# Altium schematic sheet LV_power.SchDoc
size A4; SheetNumber: 6; SheetTotal: 6
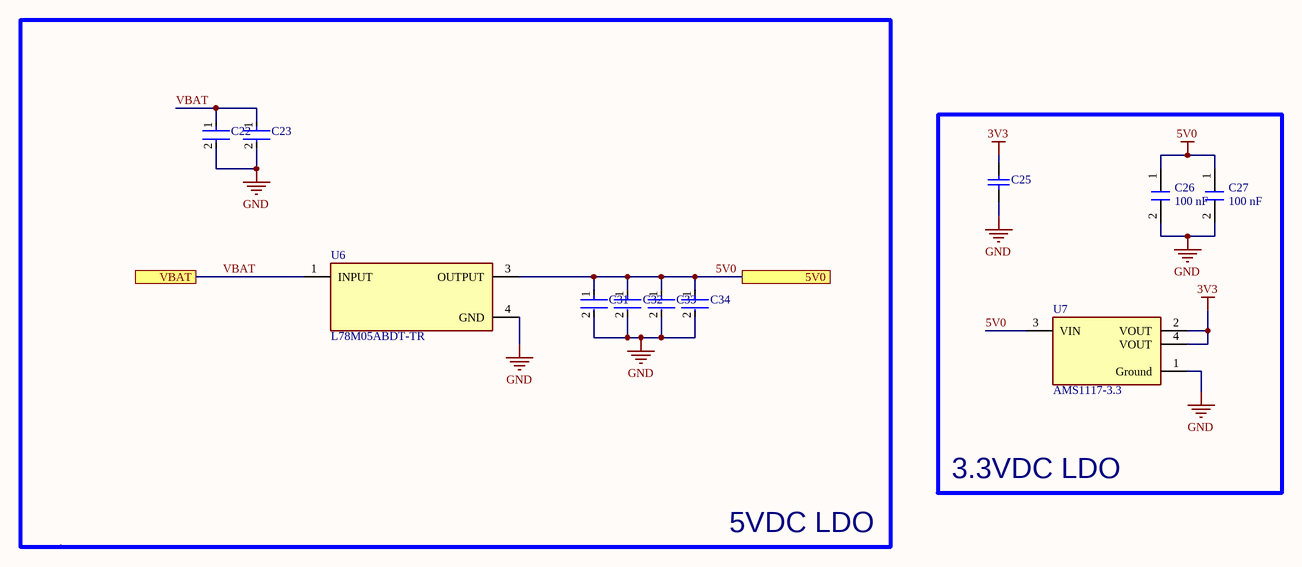
[diagram p0: LV_power.SchDoc]

## Parts
C22  CC0805MKX5R8BB226  [FP-CC0805-0_2-1_45-IPC_C]  (value not drawn)
C23  CC0805MKX5R8BB226  [FP-CC0805-0_2-1_45-IPC_C]  (value not drawn)
C25  0805ZG106ZAT2A  [CAPC2013X152X50NL20T25]  (value not drawn)
C26  value 100 nF  [0603_FP]  (hidden comment: Capacitor_0603)
C27  value 100 nF  [0603_FP]  (hidden comment: Capacitor_0603)
C31  GRM21BR61A476ME15K  [FP-GRM21B-0_2-e0_2_0_7-IPC_B]  (value not drawn)
C32  GRM21BR61A476ME15K  [FP-GRM21B-0_2-e0_2_0_7-IPC_B]  (value not drawn)
C33  GRM21BR61A476ME15K  [FP-GRM21B-0_2-e0_2_0_7-IPC_B]  (value not drawn)
C34  GRM21BR61A476ME15K  [FP-GRM21B-0_2-e0_2_0_7-IPC_B]  (value not drawn)
U6  L78M05ABDT-TR  [FP-L78M05ABDT-TR-MFG]
U7  AMS1117-3.3  [FP-AMS1117-IPC_C]

## Blocks framed on the sheet
5VDC LDO: C22 C23 C31-C34 U6
3.3VDC LDO: C25-C27 U7

## Ports
5V0 (see cd_switching[4B]), VBAT (see HV_power[1C], input_output[2D])

## Nets
3V3: C25.2 U7.2(VOUT) U7.4(VOUT)
5V0: C26.1 C27.1 C31.1 C32.1 C33.1 C34.1 U6.3(OUTPUT) U7.3(VIN) ; port 5V0
GND: C22.2 C23.2 C25.1 C26.2 C27.2 C31.2 C32.2 C33.2 C34.2 U6.4(GND) U7.1(Ground)
VBAT: C22.1 C23.1 U6.1(INPUT) ; port VBAT

## Library data of the parts
C22 C23 = CMP-03422-001497-1: CAP CER 22UF 25V X5R 0805; Tolerance: 20%; Max Operating Temperature: 85°C; Dielectric: X5R; Termination: SMD/SMT; Voltage Rating: 25V; Width: 0.049inch; Min Operating Temperature: -55°C; Case/Package: 0805; Lead Free: Lead Free; RoHS Compliant: Yes; Weight: 0.000194oz; Voltage Rating (DC): 25V; Capacitance: 22uF; Length: 0.079inch; Halogen Free: Halogen Free; Height: 1.25mm; Packaging: Tape and Reel; Package Quantity: 3000; Case Code (Metric): 2012; Thickness: 0.057inch; Case Code (Imperial): 0805; Mount: Surface Mount
C25 = CMP-2007-04523-1: Manufacturer: AVX Interconnect / Elco; Part Number: 0805ZG106ZAT2A
C26 C27 = Capacitor_0603: Format: 0402; Package: 0402
C31-C34 = CMP-06035-042633-1: Chip Multilayer Ceramic Capacitors for General Purpose, 0805, 47uF, X5R, 15%, 20%, 10V; Min Operating Temperature: -55°C; Max Operating Temperature: 85°C; Length: 0.079inch; Case Code (Imperial): 0805; Tolerance: 20%; Mount: Surface Mount; Voltage Rating (DC): 10V; Termination: SMD/SMT; Voltage Rating: 10V; Weight: 0.000335oz; Package Quantity: 10000; Dielectric: X5R; Thickness: 0.057inch; Capacitance: 47uF; Case/Package: 0805; Width: 0.049inch; Case Code (Metric): 2012; Packaging: Tape and Reel
U6 = CMP-0244-00177-2: IC REG LINEAR 5V 500MA DPAK; Polarity: Positive; Accuracy: 2%; Max Input Voltage: 35V; Tolerance: 4%; Power Supply Rejection Ratio (PSRR): 62dB; Dropout Voltage: 2V; Output Type: Fixed; Number of Regulators: 1; Min Input Voltage: 10V; Quiescent Current: 6mA; Mount: Surface Mount; Min Operating Temperature: -40°C; Lead Free: Lead Free; Number of Pins: 3; Height: 2.4mm; Weight: 0.01lb; Width: 6.2mm; Packaging: Tape and Reel; Output Current: 500mA; Output Voltage: 5V; Case/Package: TO-252; REACH SVHC: No SVHC; Max Operating Temperature: 125°C; Nominal Output Voltage: 5V; Number of Outputs: 1; Min Output Voltage: 5V; Radiation Hardening: No; Length: 6.6mm; Max Output Current: 500mA; Contact Plating: Tin; Output Voltage Accuracy: 2%; Package Quantity: 1
U7 = CMP-209535-000001-1: LDO Voltage Regulators 1A, 3.3V; Manufacturer: Advanced Monolithic Systems; Dropout Voltage: 1.1V; Output Type: Fixed; Nominal Supply Current: 5mA; Max Power Dissipation: 1.2W; Max Supply Voltage: 15V; Number Of Outputs: 1; Standoff Height: 0.64mm; Max Junction Temp: +125°C; Height: 1.8mm; Package: AMS1117; Device Class L2: Power Management ICs; ComponentLink2Description: Datasheet; ComponentLink2URL: http://www.advanced-monolithic.com/pdf/ds1117.pdf; Category: IC; RoHS: TRUE; Automotive: No; Device Class L1: Integrated Circuits (ICs); Output Current: 1A; Device Class L3: Voltage Regulators - Linear; Temperature: -40°C to +125°C; Output Voltage: 3.3V; Manufacturer Part Number: AMS1117-3.3; Temperature Range Low: -40°C; Octopart: https://octopart.com/ams1117-3.3-advanced+monolithic+systems-25899300; Lead Free: Yes; Ipc Land Pattern Name: SOT229P700X180-4; Temperature Range High: +125°C